# Altium schematic sheet MAZ000183 - Diagrama físico.SchDoc: MAZ000183 - Diagrama físico
size A; ApprovedBy: Christian Ledwidth; CheckedBy: Nahuel Martinez; Author: Santiago Marti; CompanyName: Body Health; DrawnBy: Santiago Marti; Revision: A; SheetNumber: 2; SheetTotal: 2
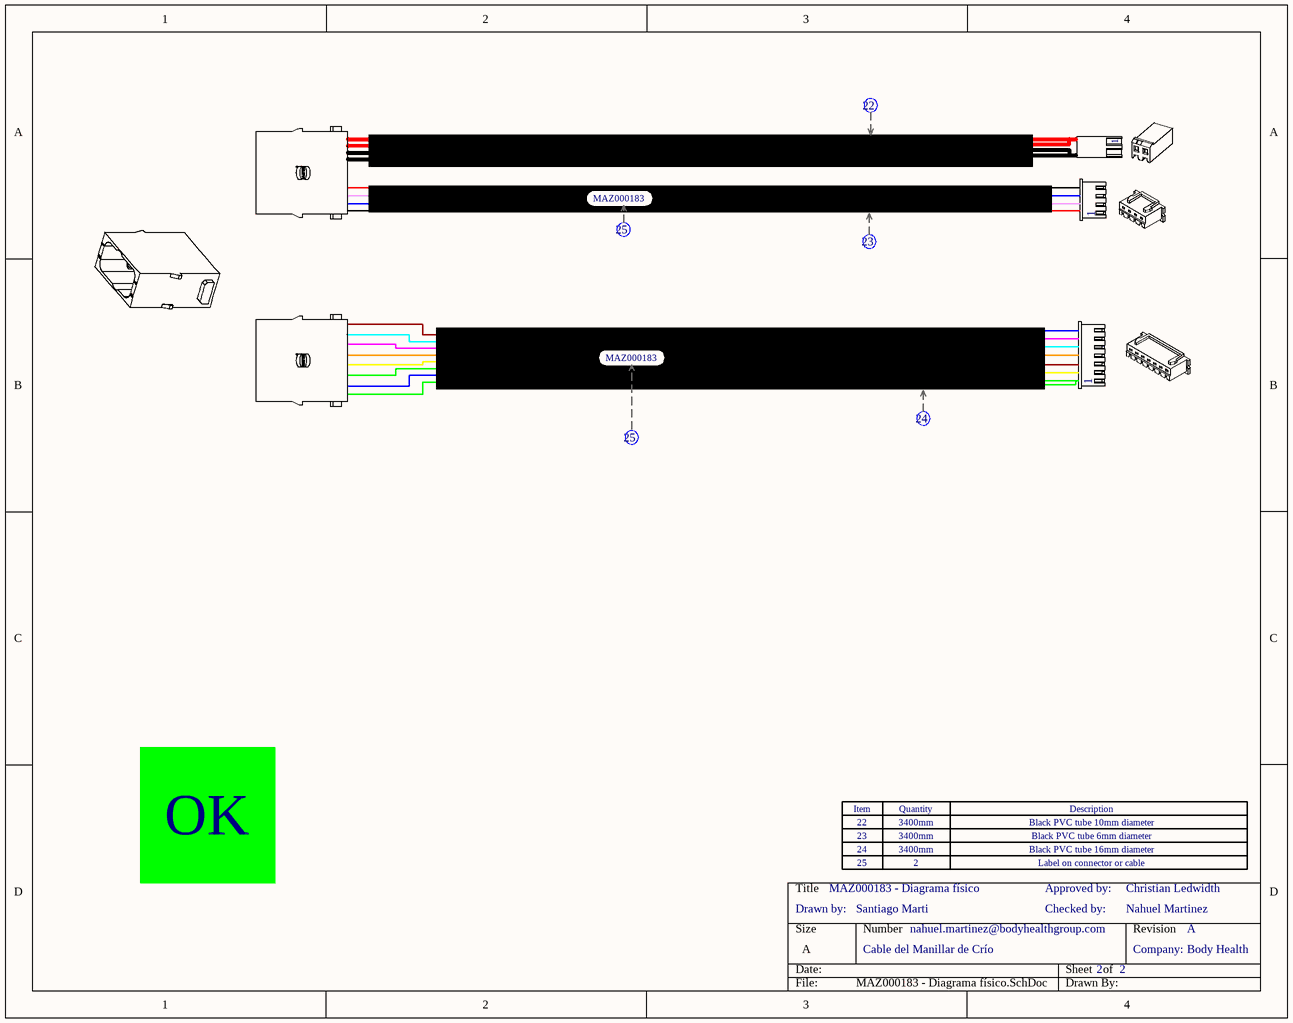
[diagram p0: MAZ000183 - Diagrama físico.SchDoc]

## Parts
(Parts that share a designator on the sheet are numbered #1, #2 ... from top to bottom, then left to right.)
Cab1  Cable  (value not drawn)
Cab?#1  Cable  (value not drawn)
Cab?#2  Cable  (value not drawn)
Cab?#3  Cable  (value not drawn)
Cab?#4  Cable  (value not drawn)
Con1  XHP-4  (value not drawn)  (parts A,B of 4)
Con4  SL156-2  (value not drawn)  (parts A,B of 4)
Con?#1  09140083001  (value not drawn)  (part A of 4)
Con?#2  09140083001  (value not drawn)  (part B of 4)
Con?#3  XHP-7  (value not drawn)  (part A of 4)
Con?#4  09140083001  (value not drawn)  (part A of 4)
Con?#5  XHP-7  (value not drawn)  (part B of 4)
Zoc1  Zócalo_Header  (value not drawn)
Zoc?#1  Zócalo_Item  (value not drawn)
Zoc?#2  Zócalo_Item  (value not drawn)
Zoc?#3  Zócalo_Item  (value not drawn)
Zoc?#4  Zócalo_Item  (value not drawn)

## Notes on the sheet
- (near Cab?#2) MAZ000183
- MAZ000183
- OK
- 22
- (near Zoc?#1) 23
- 3400mm
- Black PVC tube 10mm diameter
- Black PVC tube 6mm diameter
- (near Zoc?#4) Drawn by:
- (near Zoc?#2) 24
- (near Zoc?#3) 25
- 2
- Checked by:
- Approved by:
- Black PVC tube 16mm diameter
- Label on connector or cable
- Cable del Manillar de Crío
- nahuel.martinez@bodyhealthgroup.com
- Company:
- (in symbol Zócalo_Header) Item; Quantity; Description

## Library data of the parts
Cab1 = Cable: CallOut: 23; Largo: *mm; Sección: *mm2; Color: *
Cab?#1 = Cable: CallOut: 22; Largo: *mm; Sección: *mm2; Color: *
Cab?#2 Cab?#4 = Cable: CallOut: 25; Largo: *mm; Sección: *mm2; Color: *
Cab?#3 = Cable: CallOut: 24; Largo: *mm; Sección: *mm2; Color: *
Con1 = XHP-4: CONN HOUSING 2.5MM 4POS; Fabricante: JST Sales America Inc.; Cod.DigiKey: 455-2267-ND; Cod.Fabricante: XHP-4; ComponentLink1Description: Manufacturer Link; ComponentLink1URL: http://www.jst-mfg.com/product/pdf/eng/eXH.pdf; DIGIKEYx50: 0.06220; CallOut: *; DIGIKEYx100: NO
Con4 = SL156-2: CONN RECEPT 2 POS W/RAMP SL-156; Cod.Fabricante: 640250-2; Fabricante: TE Connectivity AMP Connectors; Cod.DigiKey: A19950-ND; ComponentLink1Description: Manufacturer Link; ComponentLink1URL: https://www.te.com/commerce/DocumentDelivery/DDEController?Action=srchrtrv&DocNm=640250&DocType=Customer+Drawing&DocLang=English; DIGIKEYx50: 0.11420; CallOut: *; DIGIKEYx100: NO
Con?#1 Con?#2 Con?#4 = 09140083001: Han E Male 8 way; Fabricante: HARTING; Cod.DigiKey: 1195-1525-ND; Cod.Fabricante: 09140083001; ComponentLink1Description: Manufacturer Link; ComponentLink1URL: https://b2b.harting.com/files/download/PRD/PDF_TS/09140083001_100121402DRW011A.pdf; DIGIKEYx50: 7.60000; CallOut: *; DIGIKEYx100: 7.40000
Con?#3 Con?#5 = XHP-7: CONN HOUSING 2.5MM 7POS; Fabricante: JST Sales America Inc.; Cod.DigiKey: 455-2269-ND; Cod.Fabricante: XHP-7; ComponentLink1Description: Manufacturer Link; ComponentLink1URL: http://www.jst-mfg.com/product/pdf/eng/eXH.pdf; DIGIKEYx50: 0.08560; CallOut: *; DIGIKEYx100: 0.08270
Zoc1 = Zócalo_Header: Header para el zócalo de referencias
Zoc?#1-Zoc?#4 = Zócalo_Item: Ítem para el zócalo de referencias; Desginator: *; Quantity: *; ItemDescription: *